# Altium project MOSFET Board Project.PrjPCB
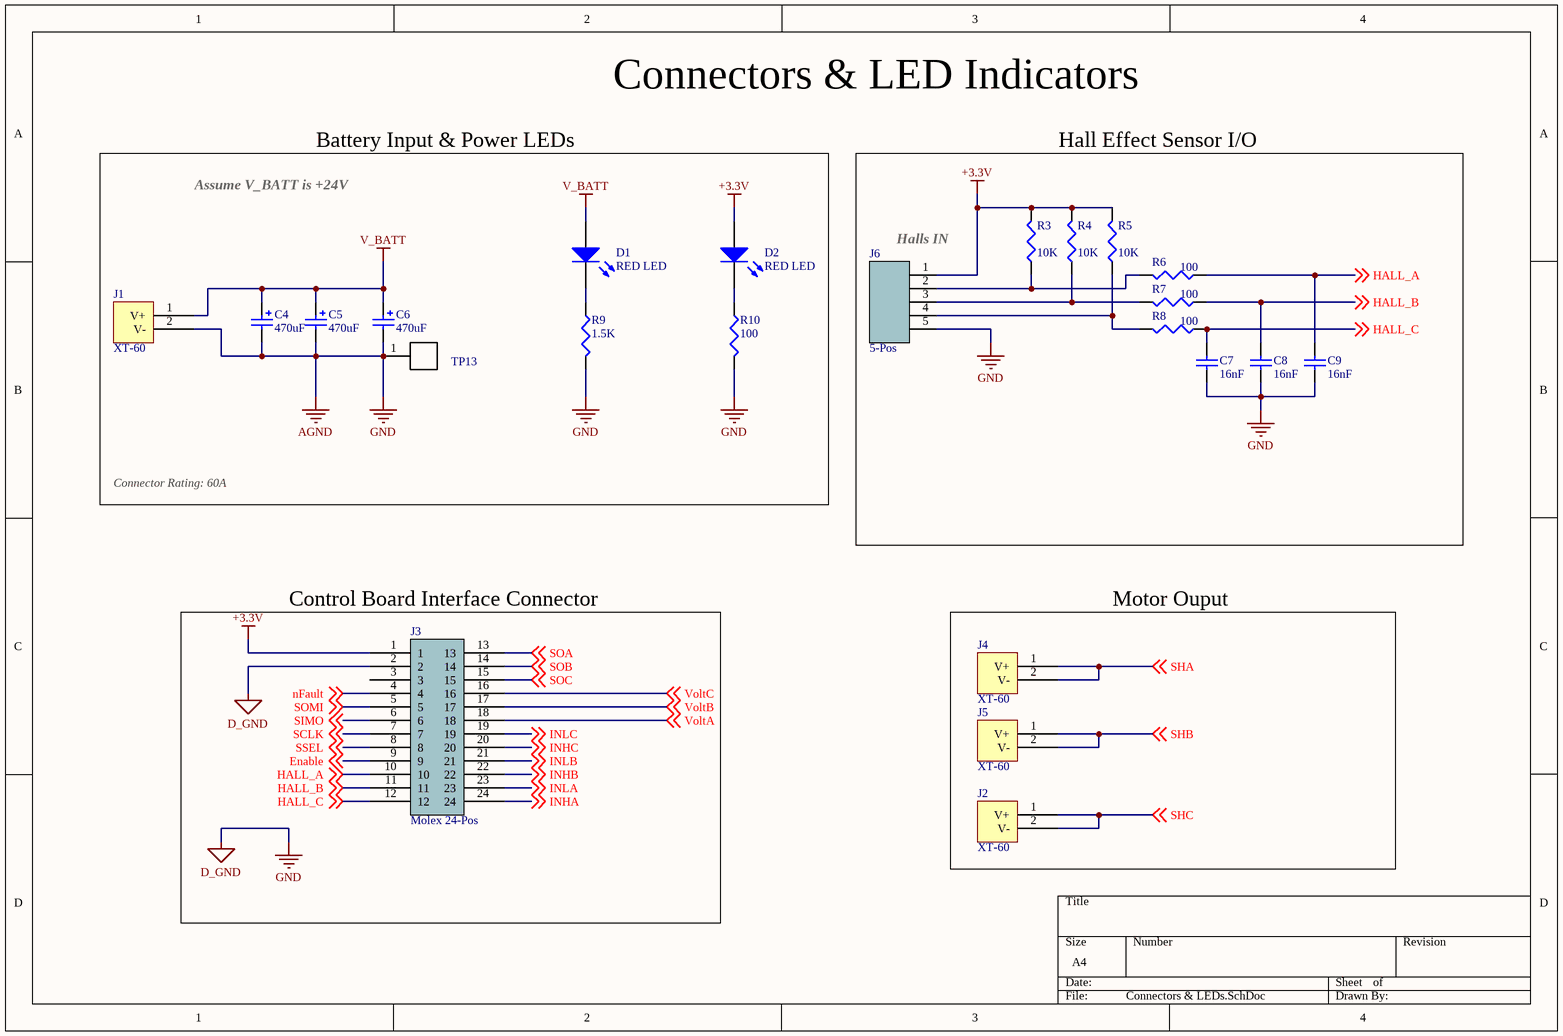
[diagram p0: Connectors & LEDs.SchDoc]
2 sheets, 60 parts. Net scope: global (net labels, ports and power ports of the same name join across sheets).
Board files: MOSFET Board Layout.PcbDoc, Power_Board_Layout_V2.PcbDoc
Sheets:
  Connectors & LEDs.SchDoc
  Gate Driver & H-Bridge.SchDoc

## Sheet Connectors & LEDs.SchDoc
size A4

### Parts
C4  470uF  [ECA1JHG471]
C5  470uF  [ECA1JHG471]
C6  470uF  [ECA1JHG471]
C7  16nF  [0603 CAP Medium]
C8  16nF  [0603 CAP Medium]
C9  16nF  [0603 CAP Medium]
D1  RED LED  [CAPC1608X05L - Polarized]
D2  RED LED  [CAPC1608X05L - Polarized]
J1  XT-60  [XTC60PW-M]
J2  XT-60  [XTC60PW-M]
J3  Molex 24-Pos  [PCBComponent_1]
J4  XT-60  [XTC60PW-M]
J5  XT-60  [XTC60PW-M]
J6  5-Pos  [Hirose 5-pos]
R3  value 10K  [RES 0603 MEDIUM]  (hidden comment: Res3)
R4  value 10K  [RES 0603 MEDIUM]  (hidden comment: Res3)
R5  value 10K  [RES 0603 MEDIUM]  (hidden comment: Res3)
R6  value 100  [RES 0603 MEDIUM]  (hidden comment: Res3)
R7  value 100  [RES 0603 MEDIUM]  (hidden comment: Res3)
R8  value 100  [RES 0603 MEDIUM]  (hidden comment: Res3)
R9  value 1.5K  [0805 Res]  (hidden comment: Res3)
R10  value 100  [RES 0603 MEDIUM]  (hidden comment: Res3)
TP13  1625854-3  [TE_RCU-0C]  (value not drawn)

### Blocks framed on the sheet
Battery Input & Power LEDs: C4-C6 D1 D2 J1 R9 R10 TP13
Hall Effect Sensor I/O: C7-C9 J6 R3-R8
Control Board Interface Connector: J3
Motor Ouput: J2 J4 J5

### Nets
+3.3V: D2.1(A) J3.1 J6.1 R3.2 R4.2 R5.2
AGND: C4.2 C5.2 C6.2 C7.1 C8.1 C9.1 J1.2(V-) J3.2 J6.5 R9.2 R10.2 TP13.1  [also labelled D_GND, GND]
V_BATT: C4.1 C5.1 C6.1 D1.1(A) J1.1(V+)
Enable: J3.9 ; off-sheet Enable
HALL_A: C9.2 J3.10 R6.1 ; off-sheet HALL_A
HALL_B: C8.2 J3.11 R7.1 ; off-sheet HALL_B
HALL_C: C7.2 J3.12 R8.1 ; off-sheet HALL_C
INHA: J3.24 ; off-sheet INHA
INHB: J3.22 ; off-sheet INHB
INHC: J3.20 ; off-sheet INHC
INLA: J3.23 ; off-sheet INLA
INLB: J3.21 ; off-sheet INLB
INLC: J3.19 ; off-sheet INLC
nFault: J3.4 ; off-sheet nFault
SCLK: J3.7 ; off-sheet SCLK
SHA: J4.1(V+) J4.2(V-) ; off-sheet SHA
SHB: J5.1(V+) J5.2(V-) ; off-sheet SHB
SHC: J2.1(V+) J2.2(V-) ; off-sheet SHC
SIMO: J3.6 ; off-sheet SIMO
SOA: J3.13 ; off-sheet SOA
SOB: J3.14 ; off-sheet SOB
SOC: J3.15 ; off-sheet SOC
SOMI: J3.5 ; off-sheet SOMI
SSEL: J3.8 ; off-sheet SSEL
VoltA: J3.18 ; off-sheet VoltA
VoltB: J3.17 ; off-sheet VoltB
VoltC: J3.16 ; off-sheet VoltC
NetD1_2: D1.2(K) R9.1
NetD2_2: D2.2(K) R10.1
NetJ6_2: J6.2 R3.1 R6.2
NetJ6_3: J6.3 R4.1 R7.2
NetJ6_4: J6.4 R5.1 R8.2

Not connected (* = marked no-connect by the designer): J3 3

### Notes on the sheet
- Connectors & LED Indicators
- Assume V_BATT is +24V
- (near J6) Halls IN
- Connector Rating: 60A

### Library data of the parts
C4-C6 = ECA-1JHG471: Cap Aluminum Lytic 470uF 63V 20% (12.5 X 20mm) Radial 5mm 640mA 2000h 105C Bulk; Manufacturer: Panasonic; Life (Hours): 2000Hour; Lead/Base Style: Straight; Polarity: Polar; Leakage Current: 3uA; Dissipation Factor: 0.1%; Lead Diameter: 0.6mm; Supplier 1: Digi-Key; Manufacturer Part Number: ECA-1JHG471; Stock 1: 12555; Pricing 1: 1=0.88, 10=0.67, 100=0.4792, 500=0.371, 1000=0.31948, 2500=0.29887, 5000=0.28341 (USD); Mount: Through Hole,PCB; Case/Package: Radial; Contact Plating: Tin; Min Operating Temperature: -55°C; Max Operating Temperature: 105°C; Capacitance: 470uF; Tolerance: 20%; Ripple Current: 640mA; Termination: Radial; Voltage Rating (DC): 63V; Packaging: Bulk; Package Quantity: 200; Voltage Rating: 63V; Voltage: 63V; Diameter: 12.5mm; Length: 20mm; Height: 20mm; Lead Pitch: 5mm; Height - Seated (Max): 0.866inch; Radiation Hardening: No; REACH SVHC: No SVHC; ComponentLink1URL: https://datasheet.ciiva.com/14590/70067776-14590006.pdf; ComponentLink1Description: https://datasheet.ciiva.com/14590/70067776-14590006.pdf; ComponentLink2URL: https://datasheet.ciiva.com/17356/aba0000ce26-17356313.pdf; ComponentLink2Description: https://datasheet.ciiva.com/17356/aba0000ce26-17356313.pdf; ComponentLink3URL: https://datasheet.ciiva.com/48521/radial-nhg-eng-tds-48521993.pdf; ComponentLink3Description: https://datasheet.ciiva.com/48521/radial-nhg-eng-tds-48521993.pdf; ComponentLink4URL: https://datasheet.ciiva.com/30116/8aba0000ce26-30116426.pdf; ComponentLink4Description: https://datasheet.ciiva.com/30116/8aba0000ce26-30116426.pdf; ComponentLink5URL: https://datasheet.ciiva.com/2984/aba0000ce26-2984364.pdf; ComponentLink5Description: https://datasheet.ciiva.com/2984/aba0000ce26-2984364.pdf; ComponentLink6URL: https://datasheet.ciiva.com/11783/0900766b800301b8-11783820.pdf; ComponentLink6Description: https://datasheet.ciiva.com/11783/0900766b800301b8-11783820.pdf; ComponentLink7URL: https://datasheet.ciiva.com/43485/1504317-43485276.pdf; ComponentLink7Description: https://datasheet.ciiva.com/43485/1504317-43485276.pdf
C7-C9 = 06035C163KAT2A: Multilayer Ceramic Capacitors MLCC - SMD/SMT 50volts 0.016uF 10% X7R; Manufacturer: Kyocera AVX; Voltage Rating: 50V; Dissipation Factor: 2.5%; Supplier 1: Digi-Key; Manufacturer Part Number: 06035C163KAT2A; Stock 1: 10610; Pricing 1: 1=0.33, 10=0.224, 100=0.1271, 500=0.0897, 1000=0.07849 (USD); Mount: Surface Mount; Case/Package: 0603; Number of Pins: 2; Case Code (Metric): 1608; Case Code (Imperial): 0603; Min Operating Temperature: -55°C; Max Operating Temperature: 125°C; Package Quantity: 4000; Capacitance: 16nF; Tolerance: 10%; Packaging: Tape and Reel; Voltage Rating (DC): 50V; Dielectric: X7R; Termination: SMD/SMT; Length: 1.6mm; Width: 0.032inch; Thickness: 0.035inch; Depth: 0.81mm; Radiation Hardening: No; ComponentLink1URL: https://datasheet.ciiva.com/205/cx7r-205833.pdf; ComponentLink1Description: https://datasheet.ciiva.com/205/cx7r-205833.pdf; ComponentLink2URL: https://datasheet.ciiva.com/5418/cx7r-218113-5418475.pdf; ComponentLink2Description: https://datasheet.ciiva.com/5418/cx7r-218113-5418475.pdf; Supplier 2: Digi-Key
D1 D2 = LTST-C191KRKT: LED RED CLEAR 0603 SMD; Manufacturer: Vishay Lite-On; Lens Colour: Colorless; Power Rating: 75mW; Luminous Intensity: 54mcd; Viewing Angle: 130°; Forward Voltage: 2V; Lens Style: Clear,Colorless,Diffused,Rectangular; Forward Current: 30mA; Dominant Wavelength: 631nm; Test Current: 20mA; Number of Elements: 1; Wavelength: 639nm; Reverse Voltage: 5V; Current: 2A; Supplier 1: Future Electronics; Manufacturer Part Number: LTST-C191KRKT; Stock 1: 1170; Pricing 1: 1=0.059, 250=0.048, 750=0.046, 1500=0.045, 2500=0.043 (USD); Mount: Surface Mount; Case/Package: 0603; Number of Pins: 2; Colour: Red; Case Code (Metric): 1608; Case Code (Imperial): 0603; Min Operating Temperature: -55°C; Max Operating Temperature: 85°C; Packaging: Tape and Reel; Package Quantity: 1; Illumination Colour: Red; Lens Transparency: Clear; Power Dissipation: 75mW; Number of LEDs: 1; Voltage: 2V; Length: 1.6mm; Height: 0.55mm; Width: 0.8mm; Depth: 0.8mm; Radiation Hardening: No; Lead Free: Lead Free; ComponentLink1URL: http://optoelectronics.liteon.com/upload/download/DS22-2000-223/LTST-C191KRKT.PDF; ComponentLink1Description: http://optoelectronics.liteon.com/upload/download/DS22-2000-223/LTST-C191KRKT.PDF; ComponentLink2URL: http://www1.futureelectronics.com/doc/LITE-ON/LTST-C191KRKT.pdf; ComponentLink2Description: http://www1.futureelectronics.com/doc/LITE-ON/LTST-C191KRKT.pdf; ComponentLink3URL: https://www.verical.com/server-webapp/html/getDatasheet?partID=141922; ComponentLink3Description: https://www.verical.com/server-webapp/html/getDatasheet?partID=141922; ComponentLink4URL: http://www.mouser.com/ds/2/239/LTST-C191KRKT-1140668.pdf; ComponentLink4Description: http://www.mouser.com/ds/2/239/LTST-C191KRKT-1140668.pdf
J1 J2 J4 J5 = XT-60: XT-60 Power Connector; Current_Max: 60; ComponentLink1Description: Mechanical; ComponentLink1URL: https://cdn.sparkfun.com/datasheets/Prototyping/xt60.pdf
J3 = Molex 24-Pos (0039301240)
J6 = 5 pos: ComponentLink1Description: 5-pos Hirose; ComponentLink1URL: https://www.digikey.ca/product-detail/en/hirose-electric-co-ltd/DF3A-5P-2DSA/H2097-ND/141521
R3-R10 = Res3: Resistor; Published: 8-Jun-2000; LatestRevisionDate: 29-May-2009; LatestRevisionNote: IPC-7351 Footprint Added.; PackageReference: J1-0603; Publisher: Altium Limited; PackageDescription: Chip Resistor
  R3-R5: ComponentLink1Description: 10KOhm; ComponentLink1URL: https://www.digikey.ca/product-detail/en/vishay-dale/CRCW060310K0FKEAHP/541-10.0KSCT-ND/2222780
  R6-R8 R10: ComponentLink1Description: 100Ohm; ComponentLink1URL: https://www.digikey.ca/product-detail/en/vishay-dale/CRCW0603100RFKEA/541-100HCT-ND/1179695
  R9: ComponentLink1Description: 1.5KOhm; ComponentLink1URL: https://www.digikey.ca/product-detail/en/rohm-semiconductor/ESR10EZPJ152/RHM1.5KKCT-ND/1762968
TP13 = RCU-0C: 0603 PROBE PAD; Resistance: <.05; Power_Rating: 0 W; MF: TE Connectivity; Tolerance: 0%; Package: 0603; Digi-Key_Part_Number: A106145CT-ND; Digi-Key_Purchase_URL: https://www.digikey.ca/product-detail/en/te-connectivity-amp-connectors/RCU-0C/A106145CT-ND/3477802?utm_source=snapeda&utm_medium=aggregator&utm_campaign=symbol; MP: RCU-0C; SnapEDA_Link: https://www.snapeda.com/parts/RCU-0C/TE%20Connectivity%20AMP%20Connectors/view-part/?ref=snap; EU_RoHS_Compliance: Compliant; TE_purchase_URL: https://www.te.com/usa-en/product-1625854-3.html?te_bu=Cor&te_type=disp&te_campaign=seda_glo_cor-seda-global-disp-prtnr-fy19-seda-model-bom-cta_sma-317_1&elqCampaignId=32493; Value: *

## Sheet Gate Driver & H-Bridge.SchDoc
size A4
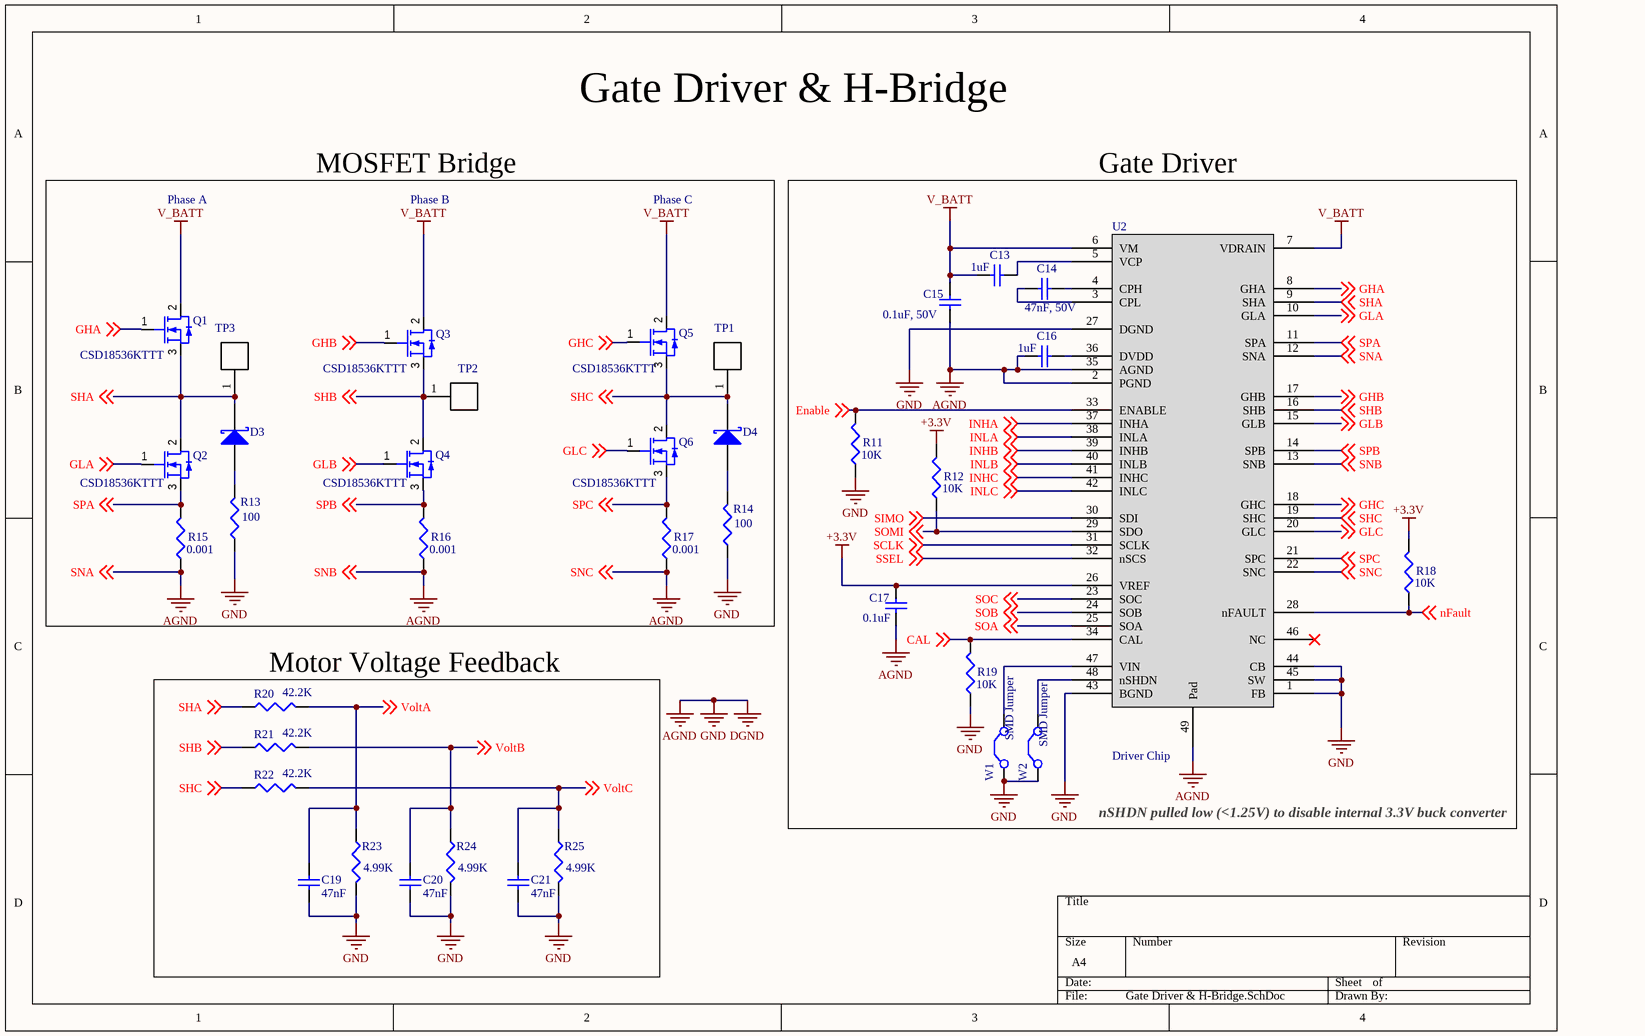
[diagram p1: Gate Driver & H-Bridge.SchDoc]

### Parts
C13  value 1uF  [CAPC2012X06N]  (hidden comment: Cap)
C14  value 47nF, 50V  [0603 CAP Medium]  (hidden comment: Cap)
C15  value 0.1uF, 50V  [0603 CAP Medium]  (hidden comment: Cap)
C16  value 1uF  [CAPC2012X06N]  (hidden comment: Cap)
C17  value 0.1uF  [0603 CAP Medium]  (hidden comment: Cap)
C19  value 47nF  [0603 CAP Medium]  (hidden comment: Cap)
C20  value 47nF  [0603 CAP Medium]  (hidden comment: Cap)
C21  value 47nF  [0603 CAP Medium]  (hidden comment: Cap)
D3  Diode 11DQ03  [Zener]  (value not drawn)
D4  Diode 11DQ03  [Zener]  (value not drawn)
Q1  CSD18536KTTT  [DPAK254P1510X470-3M]
Q2  CSD18536KTTT  [DPAK254P1510X470-3M]
Q3  CSD18536KTTT  [DPAK254P1510X470-3M]
Q4  CSD18536KTTT  [DPAK254P1510X470-3M]
Q5  CSD18536KTTT  [DPAK254P1510X470-3M]
Q6  CSD18536KTTT  [DPAK254P1510X470-3M]
R11  value 10K  [RES 0603 MEDIUM]  (hidden comment: Res3)
R12  value 10K  [RES 0603 MEDIUM]  (hidden comment: Res3)
R13  value 100  [RES 0603 MEDIUM]  (hidden comment: Res3)
R14  value 100  [RES 0603 MEDIUM]  (hidden comment: Res3)
R15  value 0.001  [RESC8032X08N]  (hidden comment: Res3)
R16  value 0.001  [RESC8032X08N]  (hidden comment: Res3)
R17  value 0.001  [RESC8032X08N]  (hidden comment: Res3)
R18  value 10K  [RES 0603 MEDIUM]  (hidden comment: Res3)
R19  value 10K  [RES 0603 MEDIUM]  (hidden comment: Res3)
R20  value 42.2K  [RES 0603 MEDIUM]  (hidden comment: Res3)
R21  value 42.2K  [RES 0603 MEDIUM]  (hidden comment: Res3)
R22  value 42.2K  [RES 0603 MEDIUM]  (hidden comment: Res3)
R23  value 4.99K  [RES 0603 MEDIUM]  (hidden comment: Res3)
R24  value 4.99K  [RES 0603 MEDIUM]  (hidden comment: Res3)
R25  value 4.99K  [RES 0603 MEDIUM]  (hidden comment: Res3)
TP1  1625854-3  [TE_RCU-0C]  (value not drawn)
TP2  1625854-3  [TE_RCU-0C]  (value not drawn)
TP3  1625854-3  [TE_RCU-0C]  (value not drawn)
U2  Driver Chip  [QFN50P700X700X100_HS-49N]
W1  SMD Jumper  [SMD Jumper]
W2  SMD Jumper  [SMD Jumper]

### Blocks framed on the sheet
MOSFET Bridge: D3 D4 Q1-Q6 R13-R17 TP1-TP3
Gate Driver: C13-C17 R11 R12 R18 R19 U2 W1 W2
Motor Voltage Feedback: C19-C21 R20-R25

### Nets
+3.3V: C17.2 R12.2 R18.2 U2.26(VREF)
AGND: C15.1 C16.1 C17.1 C19.1 C20.1 C21.1 R11.1 R13.1 R14.1 R15.1 R16.1 R17.1 R19.1 R23.2 R24.2 R25.2 U2.1(FB) U2.2(PGND) U2.12(SNA) U2.13(SNB) U2.22(SNC) U2.27(DGND) U2.35(AGND) U2.43(BGND) U2.44(CB) U2.45(SW) U2.49(Pad) W1.1(C1) W2.1(C1) ; off-sheet SNC, off-sheet SNB, off-sheet SNA  [also labelled DGND, GND, SNA, SNB, SNC]
V_BATT: C13.1 C15.2 Q1.2(D) Q3.2(D) Q5.2(D) U2.6(VM) U2.7(VDRAIN)
CAL: R19.2 U2.34(CAL) ; off-sheet CAL
Enable: R11.2 U2.33(ENABLE) ; off-sheet Enable
GHA: Q1.1(G) U2.8(GHA) ; off-sheet GHA
GHB: Q3.1(G) U2.17(GHB) ; off-sheet GHB
GHC: Q5.1(G) U2.18(GHC) ; off-sheet GHC
GLA: Q2.1(G) U2.10(GLA) ; off-sheet GLA
GLB: Q4.1(G) U2.15(GLB) ; off-sheet GLB
GLC: Q6.1(G) U2.20(GLC) ; off-sheet GLC
INHA: U2.37(INHA) ; off-sheet INHA
INHB: U2.39(INHB) ; off-sheet INHB
INHC: U2.41(INHC) ; off-sheet INHC
INLA: U2.38(INLA) ; off-sheet INLA
INLB: U2.40(INLB) ; off-sheet INLB
INLC: U2.42(INLC) ; off-sheet INLC
nFault: R18.1 U2.28(nFAULT) ; off-sheet nFault
SCLK: U2.31(SCLK) ; off-sheet SCLK
SHA: D3.2(K) Q1.3(S) Q2.2(D) R20.1 TP3.1 U2.9(SHA) ; off-sheet SHA
SHB: Q3.3(S) Q4.2(D) R21.1 TP2.1 U2.16(SHB) ; off-sheet SHB
SHC: D4.2(K) Q5.3(S) Q6.2(D) R22.1 TP1.1 U2.19(SHC) ; off-sheet SHC
SIMO: U2.30(SDI) ; off-sheet SIMO
SOA: U2.25(SOA) ; off-sheet SOA
SOB: U2.24(SOB) ; off-sheet SOB
SOC: U2.23(SOC) ; off-sheet SOC
SOMI: R12.1 U2.29(SDO) ; off-sheet SOMI
SPA: Q2.3(S) R15.2 U2.11(SPA) ; off-sheet SPA
SPB: Q4.3(S) R16.2 U2.14(SPB) ; off-sheet SPB
SPC: Q6.3(S) R17.2 U2.21(SPC) ; off-sheet SPC
SSEL: U2.32(nSCS) ; off-sheet SSEL
VoltA: C19.2 R20.2 R23.1 ; off-sheet VoltA
VoltB: C20.2 R21.2 R24.1 ; off-sheet VoltB
VoltC: C21.2 R22.2 R25.1 ; off-sheet VoltC
NetC13_2: C13.2 U2.5(VCP)
NetC14_1: C14.1 U2.3(CPL)
NetC14_2: C14.2 U2.4(CPH)
NetC16_2: C16.2 U2.36(DVDD)
NetD3_1: D3.1(A) R13.2
NetD4_1: D4.1(A) R14.2
NetU2_47: U2.47(VIN) W1.2(C2)
NetU2_48: U2.48(nSHDN) W2.2(C2)

Not connected (* = marked no-connect by the designer): U2 46(NC)*

### Notes on the sheet
- Gate Driver & H-Bridge
- Phase A
- Phase B
- Phase C
- nSHDN pulled low (<1.25V) to disable internal 3.3V buck converter

### Library data of the parts
C13-C17 C19-C21 = Cap: Capacitor; Published: 8-Jun-2000; LatestRevisionDate: 17-Jul-2002; LatestRevisionNote: Re-released for DXP Platform.; PackageReference: RAD-0.3; Publisher: Altium Limited; PackageDescription: Radial Cap, Thru-Hole; 2 Leads; 0.3 in Pin Spacing
  C13 C16: ComponentLink1Description: 1uF, 50V; ComponentLink1URL: https://www.digikey.ca/product-detail/en/samsung-electro-mechanics/CL21B105KBFNNNG/1276-6470-1-ND/5958098
  C14 C19-C21: ComponentLink1Description: 0.047uF, 50V; ComponentLink1URL: https://www.digikey.ca/product-detail/en/samsung-electro-mechanics/CL10B473KB8NFNC/1276-2075-1-ND/3890161
  C15 C17: ComponentLink1Description: 0.1uF, 50V; ComponentLink1URL: https://www.digikey.ca/product-detail/en/samsung-electro-mechanics/CL10B104KB8WPNC/1276-6854-1-ND/5961713
D3 D4 = Diode 11DQ03: Schottky Rectifier; Published: 8-Jun-2000; LatestRevisionDate: 17-Jul-2002; LatestRevisionNote: Re-released for DXP Platform.; DatasheetVersion: Dec-1997; PackageReference: DO-204AL; Publisher: Altium Limited; PackageDescription: Diode, Axial; Body 5.2 x 2.7 mm (LxDia. max), Lead Dia. 0.86 mm (max); Code_JEDEC: DO-204-AL; ComponentLink1Description: Zener; ComponentLink1URL: https://www.digikey.ca/product-detail/en/micro-commercial-co/SMBJ5362B-TP/SMBJ5362B-TPMSCT-ND/1636228
Q1-Q6 = CSD18536KTTT: TEXAS INSTRUMENTS         CSD18536KTTT             MOSFET Transistor, NexFET, N Channel, 349 A, 60 V, 0.0013 ohm, 10 V, 1.8 V; Drain to Source Voltage (Vdss): 60V; Continuous Drain Current (ID): 349A; Rds On Max: 1.6mR; Input Capacitance: 11.43nF; Max Power Dissipation: 375W; Element Configuration: Single; Threshold Voltage: 1.8V; Supplier 1: Digi-Key; Manufacturer: Texas Instruments; Manufacturer Part Number: CSD18536KTTT; RoHS: No; Stock 1: 306; Pricing 1: 1 = 5.25000, 10 = 4.69200 (USD); Mount: Surface Mount; Case/Package: D2PAK; Number of Pins: 3; Min Operating Temperature: -55°C; Max Operating Temperature: 175°C; Packaging: Tape and Reel; Lead Free: Contains Lead; REACH SVHC: No SVHC
R11-R25 = Res3: Resistor; Published: 8-Jun-2000; LatestRevisionDate: 29-May-2009; LatestRevisionNote: IPC-7351 Footprint Added.; PackageReference: J1-0603; Publisher: Altium Limited; PackageDescription: Chip Resistor
  R11 R12 R18 R19: ComponentLink1Description: 10KOhm; ComponentLink1URL: https://www.digikey.ca/product-detail/en/vishay-dale/CRCW060310K0FKEAHP/541-10.0KSCT-ND/2222780
  R13 R14: ComponentLink1Description: 100Ohm; ComponentLink1URL: https://www.digikey.ca/product-detail/en/vishay-dale/RCP0603W100RGEB/541-2653-2-ND/5481867
  R15 R17: ComponentLink1Description: CS Res; ComponentLink1URL: https://www.digikey.ca/product-detail/en/stackpole-electronics-inc/CSNL2512FT1L00/CSNL2512FT1L00CT-ND/1646259
  R20-R22: ComponentLink1Description: 42.2KOhm; ComponentLink1URL: https://www.digikey.ca/product-detail/en/stackpole-electronics-inc/RMCF0603FT42K2/RMCF0603FT42K2CT-ND/1943096
  R23-R25: ComponentLink1Description: 4.99KOhm; ComponentLink1URL: https://www.digikey.ca/product-detail/en/vishay-dale/CRCW06034K99FKEAC/541-3985-1-ND/7928668
TP1-TP3 = RCU-0C: as TP13 on sheet Connectors & LEDs; Package: 0603; Digi-Key_Part_Number: A106145CT-ND; Digi-Key_Purchase_URL: https://www.digikey.ca/product-detail/en/te-connectivity-amp-connectors/RCU-0C/A106145CT-ND/3477802?utm_source=snapeda&utm_medium=aggregator&utm_campaign=symbol; MP: RCU-0C; SnapEDA_Link: https://www.snapeda.com/parts/RCU-0C/TE%20Connectivity%20AMP%20Connectors/view-part/?ref=snap; EU_RoHS_Compliance: Compliant; TE_purchase_URL: https://www.te.com/usa-en/product-1625854-3.html?te_bu=Cor&te_type=disp&te_campaign=seda_glo_cor-seda-global-disp-prtnr-fy19-seda-model-bom-cta_sma-317_1&elqCampaignId=32493; Value: *
W1 W2 = SMD Jumper: SMD solder jumper
U2 = Driver Chip: ComponentLink1Description: Gate Driver; ComponentLink1URL: https://www.digikey.ca/product-detail/en/texas-instruments/DRV8323RSRGZT/296-46943-1-ND/7356148

## Nets that join several sheets
+3.3V: Connectors & LEDs (6 pins), Gate Driver & H-Bridge (C17.2 R12.2 R18.2 U2.26)
AGND: Connectors & LEDs (12 pins), Gate Driver & H-Bridge (29 pins)
V_BATT: Connectors & LEDs (5 pins), Gate Driver & H-Bridge (7 pins)
Enable: Connectors & LEDs (J3.9), Gate Driver & H-Bridge (R11.2 U2.33)
INHA: Connectors & LEDs (J3.24), Gate Driver & H-Bridge (U2.37)
INHB: Connectors & LEDs (J3.22), Gate Driver & H-Bridge (U2.39)
INHC: Connectors & LEDs (J3.20), Gate Driver & H-Bridge (U2.41)
INLA: Connectors & LEDs (J3.23), Gate Driver & H-Bridge (U2.38)
INLB: Connectors & LEDs (J3.21), Gate Driver & H-Bridge (U2.40)
INLC: Connectors & LEDs (J3.19), Gate Driver & H-Bridge (U2.42)
nFault: Connectors & LEDs (J3.4), Gate Driver & H-Bridge (R18.1 U2.28)
SCLK: Connectors & LEDs (J3.7), Gate Driver & H-Bridge (U2.31)
SHA: Connectors & LEDs (J4.1 J4.2), Gate Driver & H-Bridge (6 pins)
SHB: Connectors & LEDs (J5.1 J5.2), Gate Driver & H-Bridge (5 pins)
SHC: Connectors & LEDs (J2.1 J2.2), Gate Driver & H-Bridge (6 pins)
SIMO: Connectors & LEDs (J3.6), Gate Driver & H-Bridge (U2.30)
SOA: Connectors & LEDs (J3.13), Gate Driver & H-Bridge (U2.25)
SOB: Connectors & LEDs (J3.14), Gate Driver & H-Bridge (U2.24)
SOC: Connectors & LEDs (J3.15), Gate Driver & H-Bridge (U2.23)
SOMI: Connectors & LEDs (J3.5), Gate Driver & H-Bridge (R12.1 U2.29)
SSEL: Connectors & LEDs (J3.8), Gate Driver & H-Bridge (U2.32)
VoltA: Connectors & LEDs (J3.18), Gate Driver & H-Bridge (C19.2 R20.2 R23.1)
VoltB: Connectors & LEDs (J3.17), Gate Driver & H-Bridge (C20.2 R21.2 R24.1)
VoltC: Connectors & LEDs (J3.16), Gate Driver & H-Bridge (C21.2 R22.2 R25.1)